# Altium project H93 LDCU FCT Tester.PrjPCB
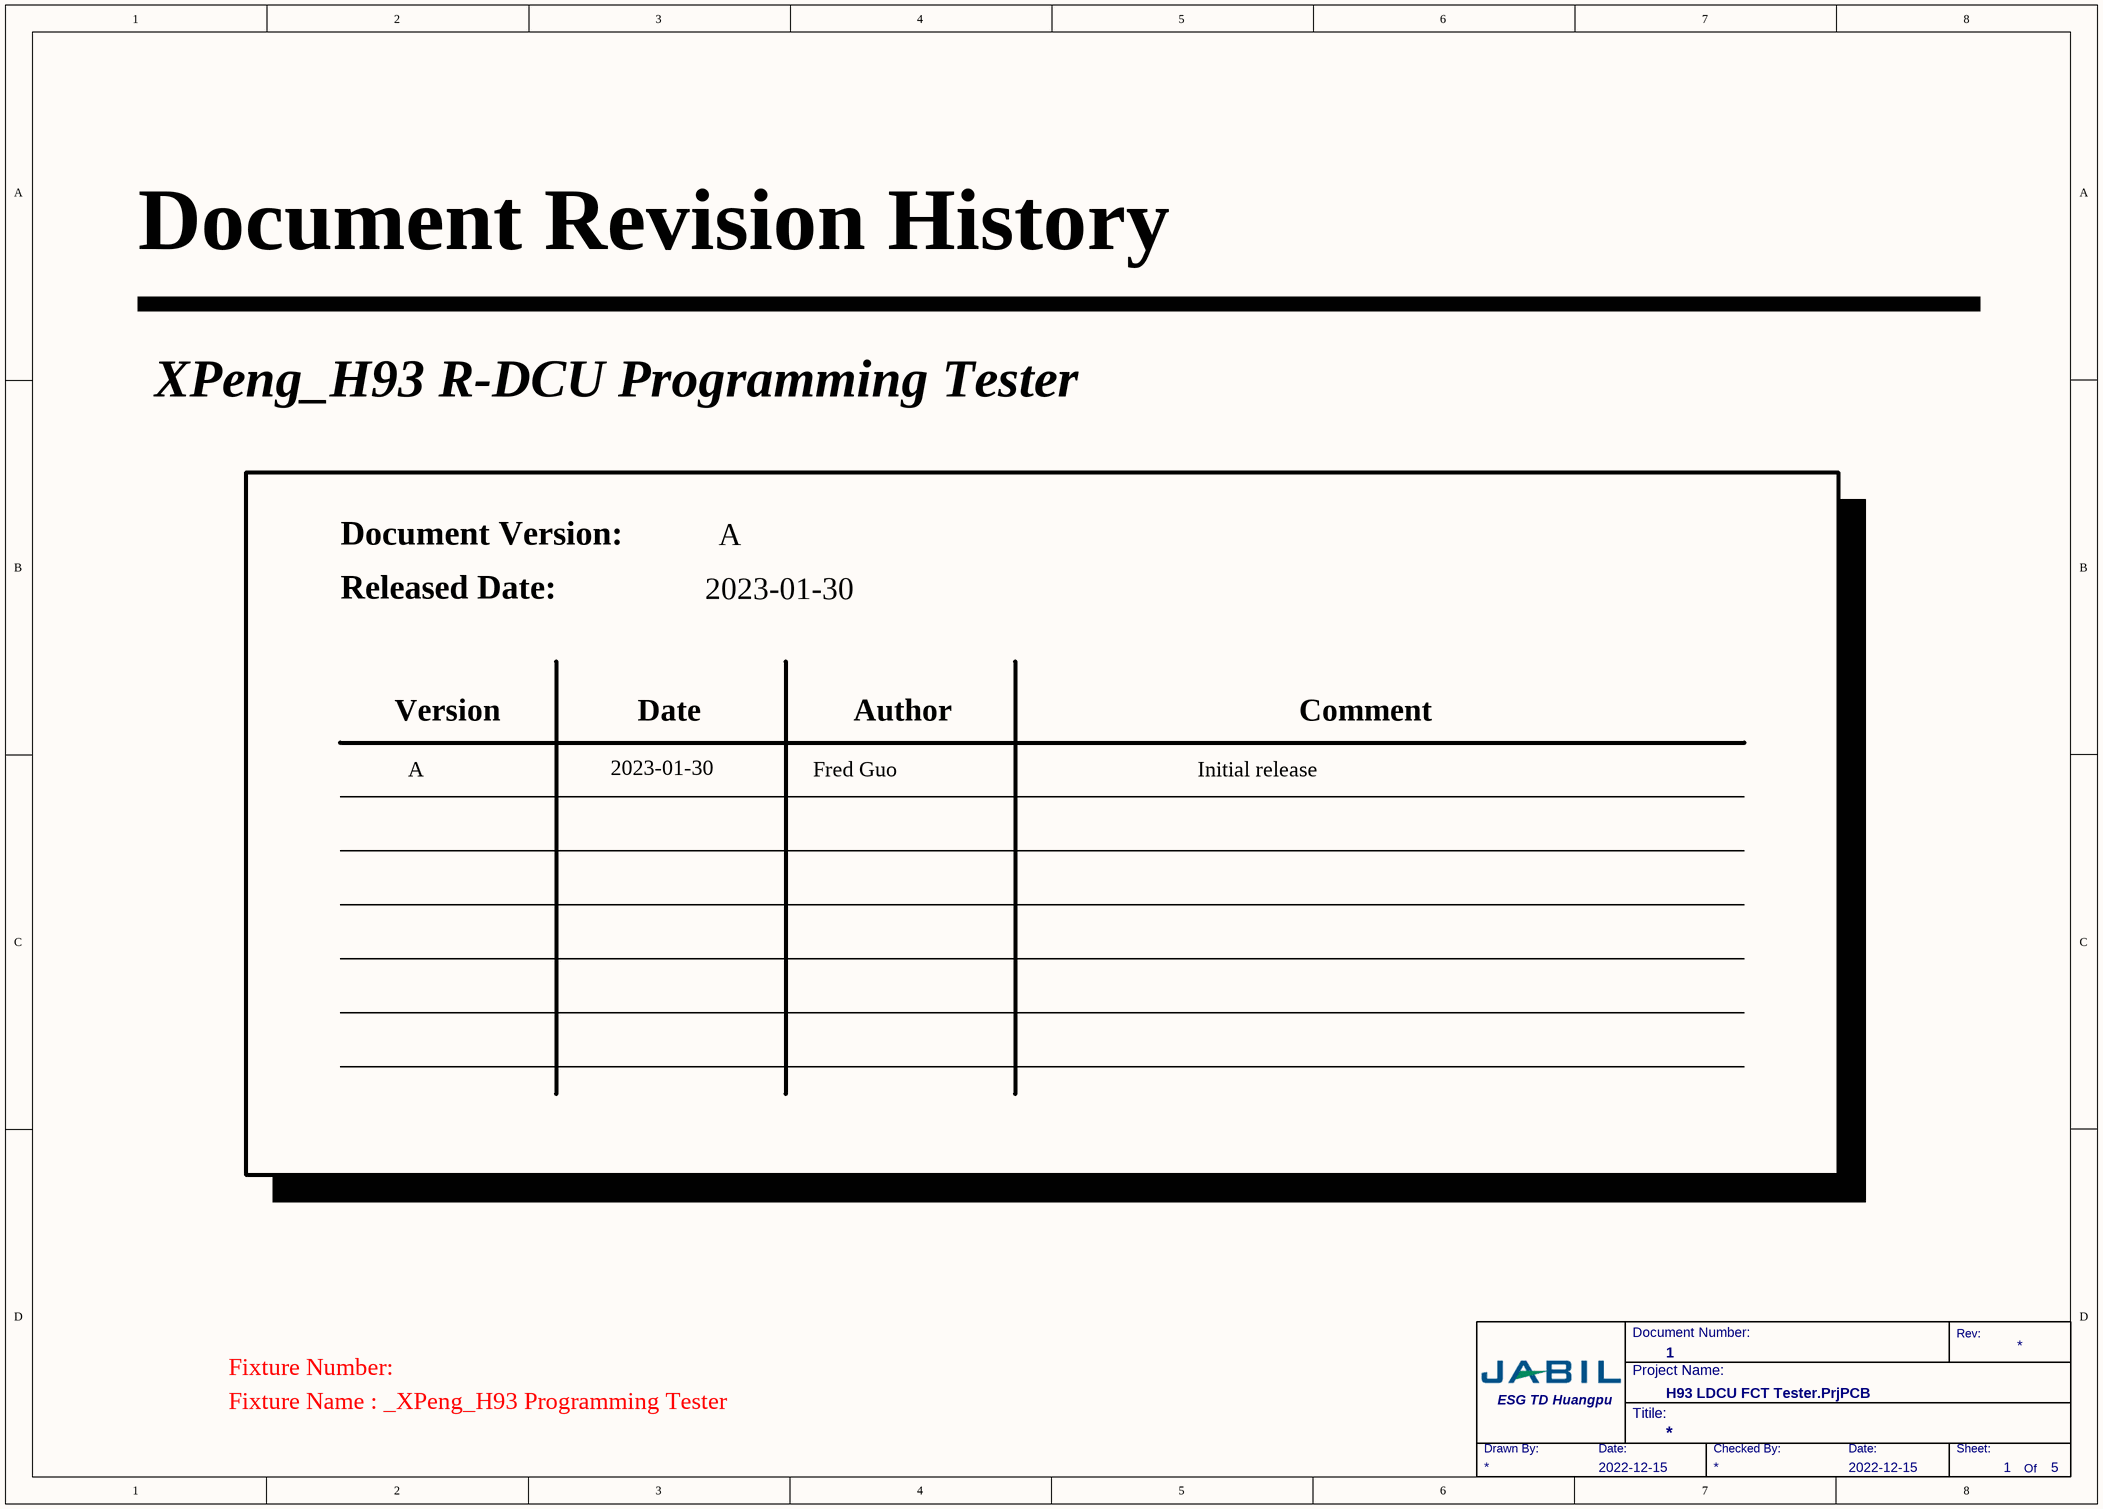
[diagram p0: History.SchDoc]
7 sheets, 50 parts. Net scope: flat (ports and power ports of the same name join across sheets).
Sheets:
  History.SchDoc
  Base AC System.SchDoc
  Base Wiring.SchDoc
  Fixture Control Wiring.SchDoc
  DUT Connect Wiring.SchDoc
  Sheet1.SchDoc
  Sheet2.SchDoc

## Sheet History.SchDoc
size A3; DocumentNumber: 1; SheetNumber: 1; SheetTotal: 5; SheetSize: A3; CheckedByDate: 2022-12-15; DrawByDate: 2022-12-15; SiteName: ESG TD Huangpu

### Notes on the sheet
- Document Revision History
- XPeng_H93 R-DCU Programming Tester
- Document Version:
- A
- Released Date:
- 2023-01-30
- Version
- Date
- Fred Guo
- Author
- Initial release
- Comment
- Fixture Number:
- Fixture Name : _XPeng_H93 Programming Tester
- Document Number:
- Project Name:
- Rev:
- Drawn By:
- Date:
- Titile:
- Checked By:
- Sheet:
- Of

## Sheet Base AC System.SchDoc
size A3; DocumentNumber: 2; SheetNumber: 2; SheetTotal: 5; SheetSize: A3; CheckedByDate: 2022-12-15; DrawByDate: 2022-12-15; SiteName: ESG TD Huangpu
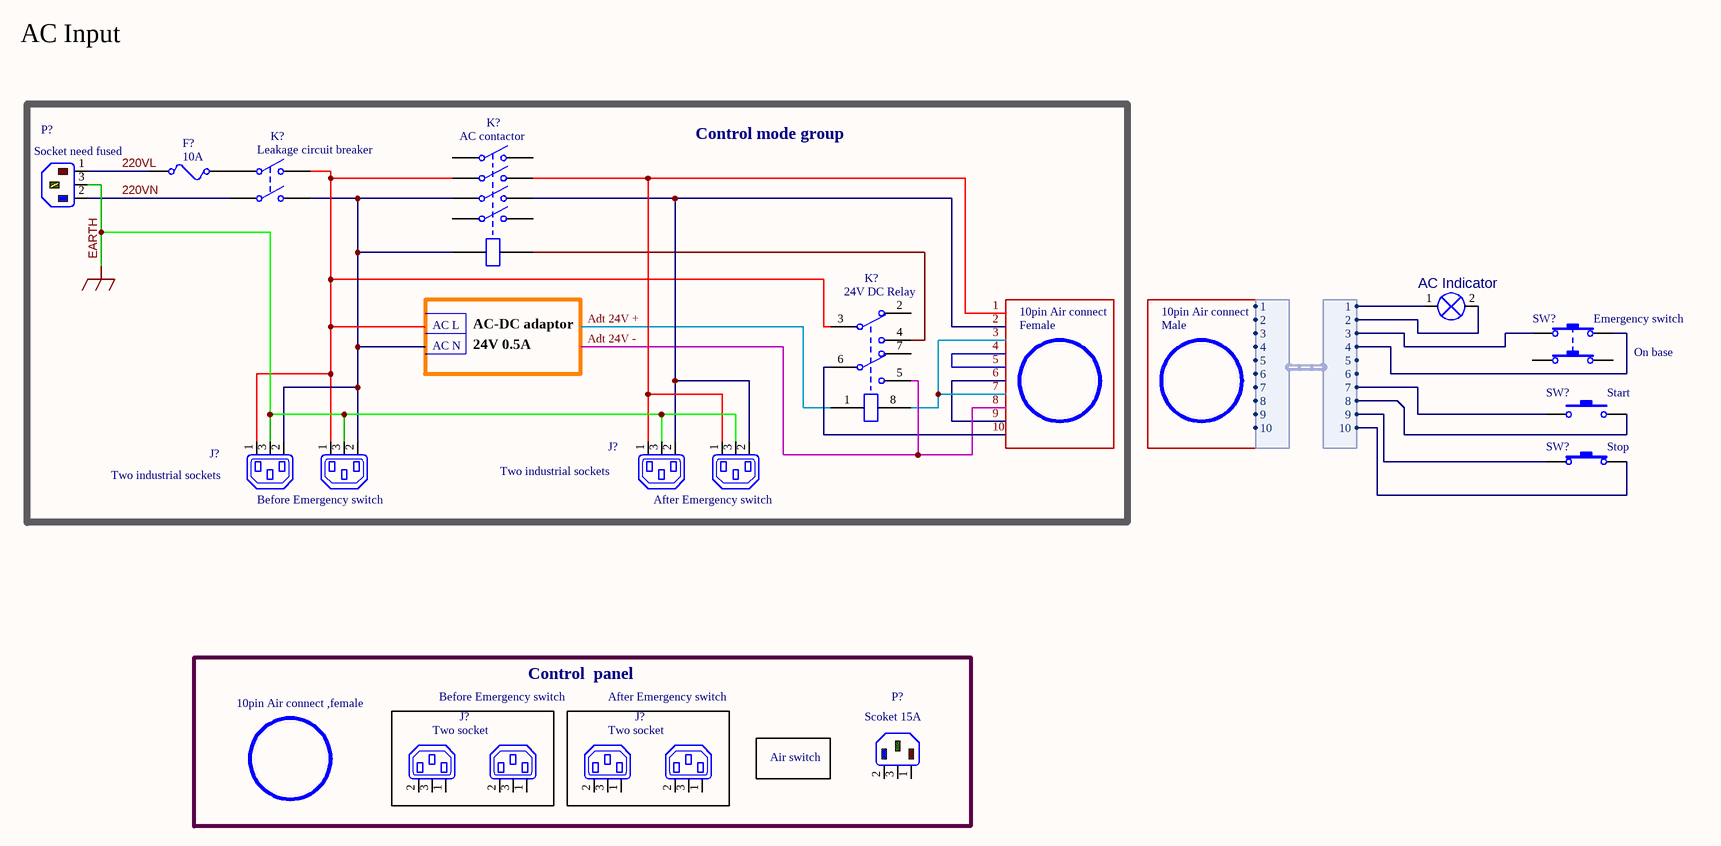
[diagram p1: Base AC System.SchDoc]

### Parts
(Parts that share a designator on the sheet are numbered #1, #2 ... from top to bottom, then left to right.)
F?  10A  [FUSE]
J?#1  Two industrial sockets  [IEC7-2H3]
J?#2  Plug AC Female  [IEC7-2H3]  (value not drawn)
J?#3  Two industrial sockets  [IEC7-2H3]
J?#4  两位工业插座  [IEC7-2H3]  (value not drawn)
J?#5  Two socket  [IEC7-2H3]
J?#6  工业插座  [IEC7-2H3]  (value not drawn)
J?#7  Two socket  [IEC7-2H3]
J?#8  工业插座  [IEC7-2H3]  (value not drawn)
K?#1  Leakage circuit breaker  [DPST-4]
K?#2  AC contactor
K?#3  24V DC Relay  [G2R-2]
Lamp?  AC Indicator
P?#1  Socket need fused  [IEC9.14-2H3]
P?#2  Scoket 15A  [IEC9.14-2H3]
SW?#1  Emergency switch  Remark: On base
SW?#2  Start
SW?#3  Stop

### Blocks framed on the sheet
Control mode group: F? J?#1-J?#4 K?#1-K?#3 P?#1
Control  panel: P?#2
Before Emergency switch: J?#5 J?#6
After Emergency switch: J?#7 J?#8

### Harnesses
Harness8: 1, 2, 3, 4, 5, 6, 7, 8, 9, 10

### Nets
EARTH: J?#1.3(E) J?#2.3(E) J?#3.3(E) J?#4.3(E) P?#1.3(E)  [also labelled GND_EARTH]
1: J?#3.1(L) J?#4.1(L) K?#2.10
2: J?#3.2(N) J?#4.2(N) K?#2.4
3: K?#3.8  [also labelled 7]
8: K?#3.5  [also labelled Adt 24V -]
10: K?#3.6
220VL: F?.1 P?#1.1(L)
220VN: K?#1.3(COMMON2) P?#1.2(N)
Adt 24V +: K?#3.1
NetF?_2: F?.2 K?#1.1(COMMON1)
NetJ?#1_1: J?#1.1(L) J?#2.1(L) K?#1.2(NO1) K?#2.9 K?#3.3
NetJ?#1_2: J?#1.2(N) J?#2.2(N) K?#1.4(NO2) K?#2.1 K?#2.3
NetK?#2_8: K?#2.8 K?#3.4
NetLamp?_1: Lamp?.1 ; harness Harness8.1
NetLamp?_2: Lamp?.2 ; harness Harness8.2
NetSW?#1_1: SW?#1.1 ; harness Harness8.3
NetSW?#1_2: SW?#1.2 ; harness Harness8.4
NetSW?#2_1: SW?#2.1 ; harness Harness8.7
NetSW?#2_2: SW?#2.2 ; harness Harness8.8
NetSW?#3_1: SW?#3.1 ; harness Harness8.9
NetSW?#3_2: SW?#3.2 ; harness Harness8.10

Not connected (* = marked no-connect by the designer): J?#5 1(L) 2(N) 3(E); J?#6 1(L) 2(N) 3(E); J?#7 1(L) 2(N) 3(E); J?#8 1(L) 2(N) 3(E); K?#2 6 7 11 12; K?#3 2 7; P?#2 1(L) 2(N) 3(E); SW?#1 3 4

### Notes on the sheet
- AC Input
- AC L
- AC N
- AC-DC adaptor
- 24V 0.5A
- 10pin Air connect
- Female
- Male
- (near J?#2) Before Emergency switch
- (near J?#3) After Emergency switch
- 10pin Air connect ,female
- Air switch
- Document Number:
- Project Name:
- Rev:
- Drawn By:
- Date:
- Titile:
- Checked By:
- Sheet:
- Of

### Library data of the parts
F? = FUSE
J?#1-J?#8 = Plug AC Female: IEC Mains Power Outlet, EN60 320-2-2 F Class I, PC Flange Rear Mount, Chassis Socket; PackageDocument: ver.80, 15-Sep-2003; MaximumRating: 10A, 250V a.c. (UL & CSA 15A, 250V a.c.); MountingFixtures: Not drawn on schematic symbol.; PCB_Layout: Complies with manufacturer's recommendation.; DrillSize: Corresponds to nominal value.; Published: 15-Jul-2004; LatestRevisionDate: 15-Jul-2004; LatestRevisionNote: Component Replaced & renamed from "Phonejack".; DatasheetDocument: ver.80, 15-Sep-2003; PackageReference: PX0675/PC; Publisher: Altium Limited; Terminations: P.C. Spills; ComponentLink1Description: Manufacturer Link; ComponentLink1URL: http://www.bulgin.co.uk/
K?#1 = SW-DPST: Double-Pole, Single-Throw Switch; Published: 24-Mar-1999; LatestRevisionDate: 17-Jul-2002; LatestRevisionNote: Re-released for DXP Platform.; PackageReference: DPST-4; Publisher: Altium Limited
K?#2 = AC CONTACTER
K?#3 = G2R-2
Lamp? = Lamp3
P?#1 P?#2 = Plug AC Male: IEC Mains Power Inlet, EN60 320-1 C14 Class I Cold Condition, PC Flange Rear Mount, Chassis Plug; PackageDocument: ver.80, 15-Sep-2003; MaximumRating: 10A, 250V a.c. (UL & CSA 15A, 250V a.c.); MountingFixtures: Not drawn on schematic symbol.; PCB_Layout: Complies with manufacturer's recommendation.; DrillSize: Corresponds to nominal value.; Note: IEC Color Scheme employed for L, N and E.; Published: 15-Jul-2004; LatestRevisionDate: 15-Jul-2004; LatestRevisionNote: Component Replaced.; DatasheetDocument: ver.80, 15-Sep-2003; PackageReference: PX0580/PC; Publisher: Altium Limited; Terminations: P.C. Spills; ComponentLink1Description: Manufacturer Link; ComponentLink1URL: http://www.bulgin.co.uk/
SW?#1 = Emergency: Switch; Published: 24-Mar-1999; LatestRevisionDate: 17-Jul-2002; LatestRevisionNote: Re-released for DXP Platform.; PackageReference: SPST-2; Publisher: Altium Limited
SW?#2 = SW-NO: Switch; Published: 24-Mar-1999; LatestRevisionDate: 17-Jul-2002; LatestRevisionNote: Re-released for DXP Platform.; PackageReference: SPST-2; Publisher: Altium Limited
SW?#3 = SW-NC: Switch; Published: 24-Mar-1999; LatestRevisionDate: 17-Jul-2002; LatestRevisionNote: Re-released for DXP Platform.; PackageReference: SPST-2; Publisher: Altium Limited

## Sheet Base Wiring.SchDoc
size A3; DocumentNumber: 3; SheetNumber: 3; SheetTotal: 5; SheetSize: A3; CheckedByDate: 2022-12-15; DrawByDate: 2022-12-15; SiteName: ESG TD Huangpu
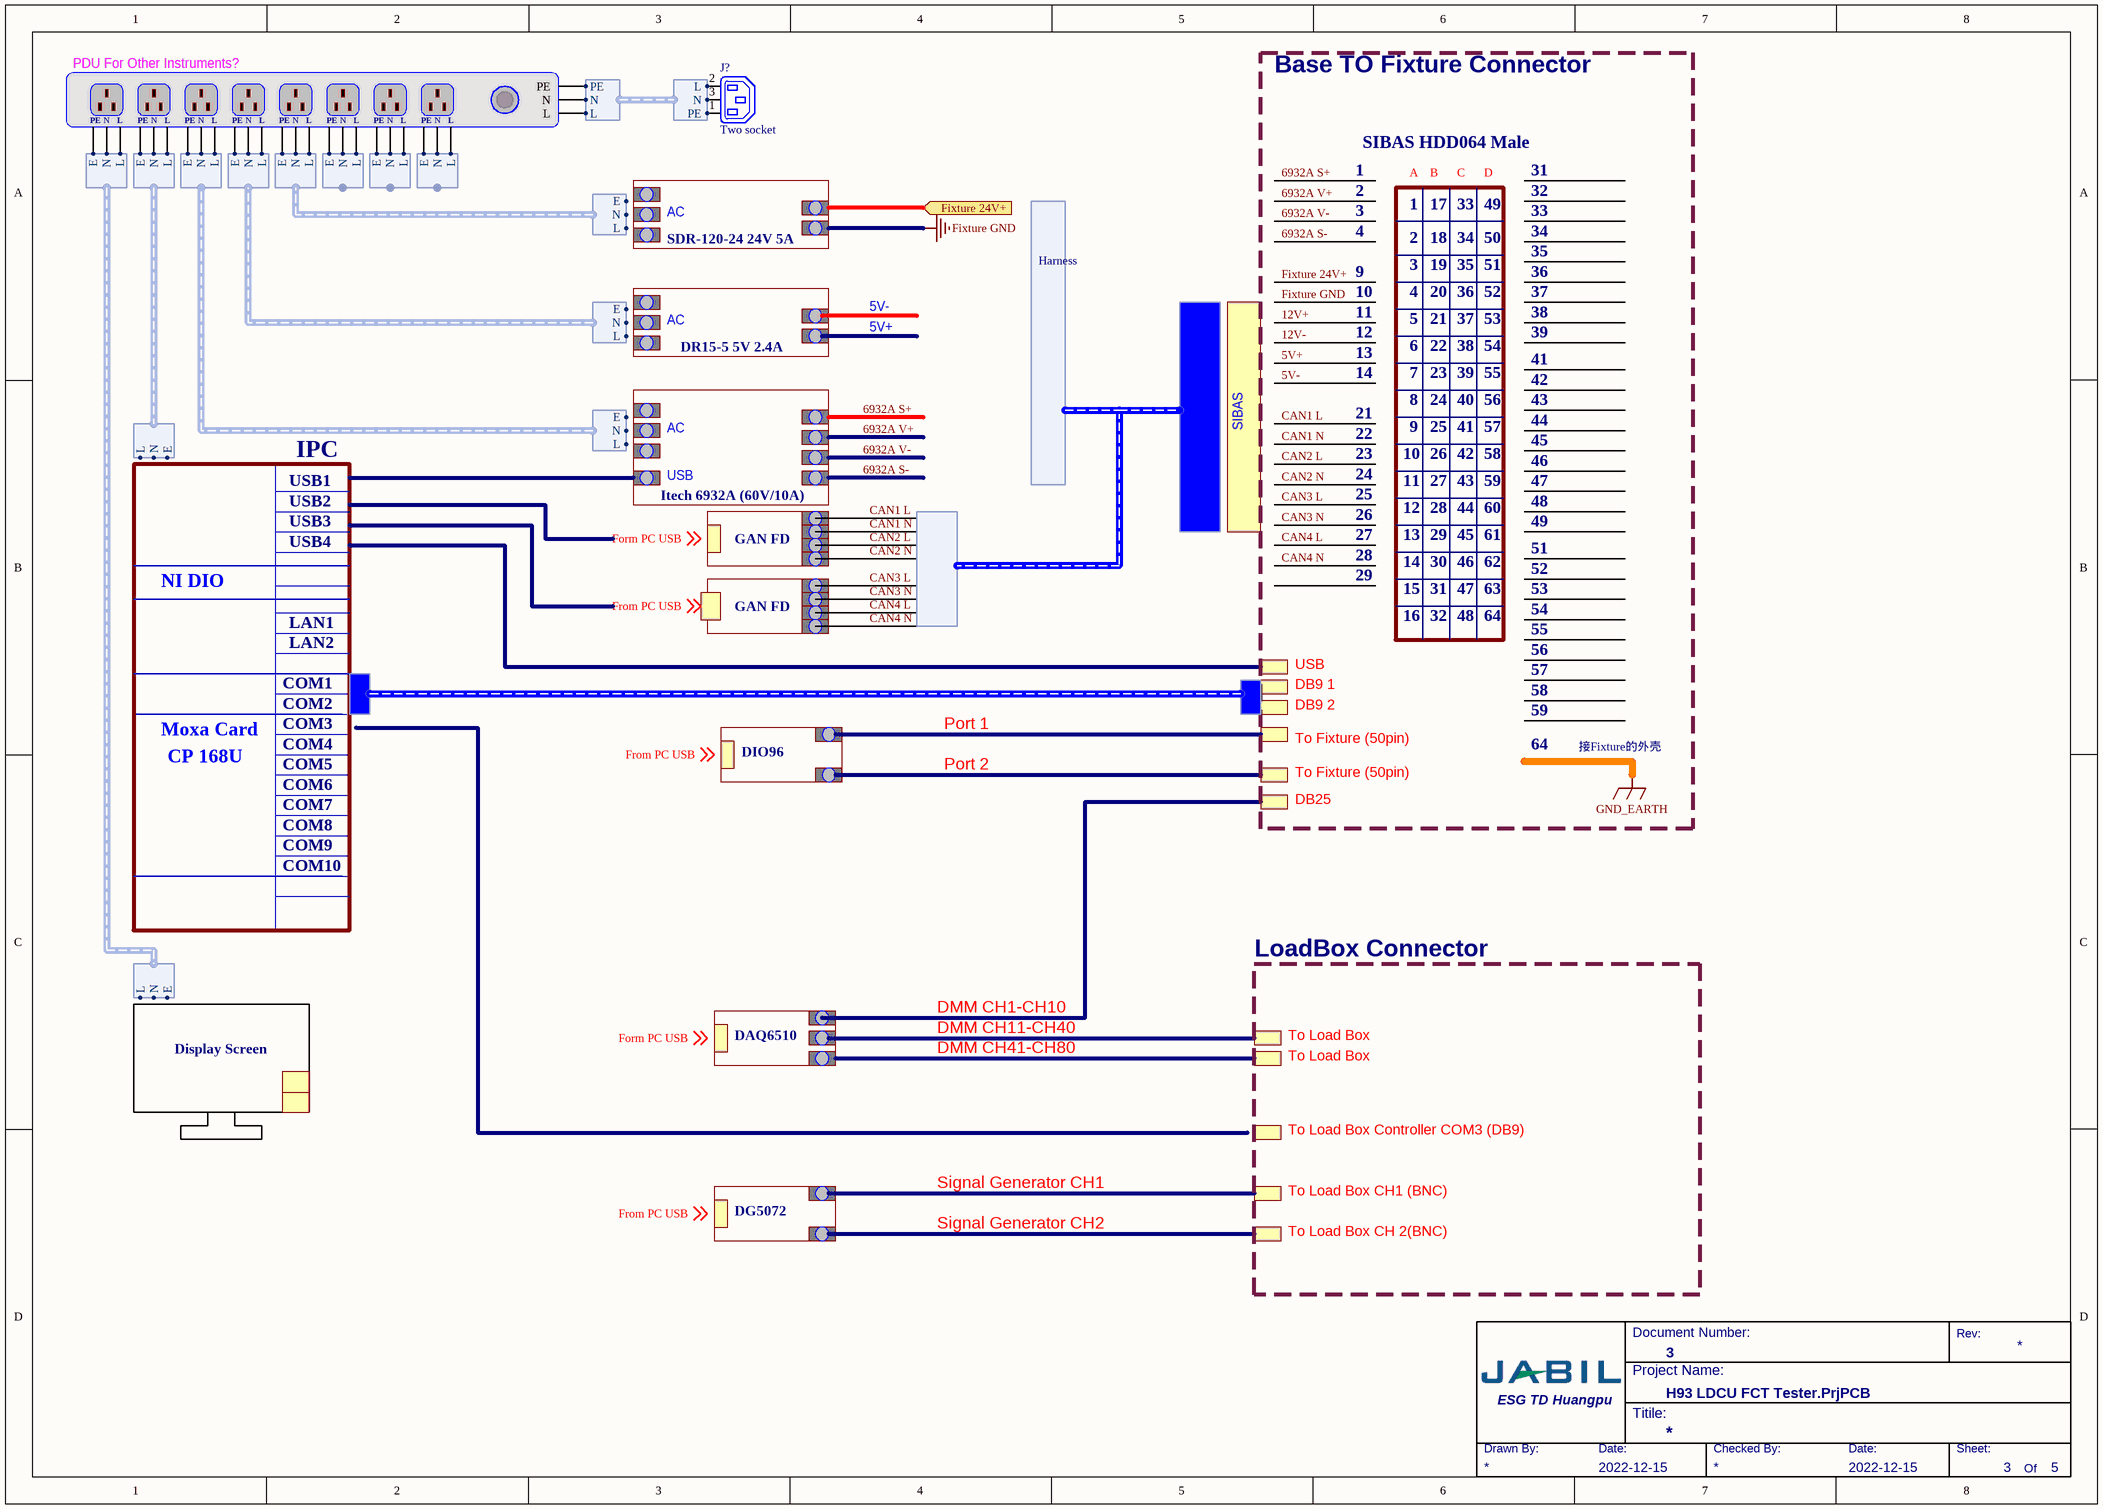
[diagram p2: Base Wiring.SchDoc]

### Parts
(Parts that share a designator on the sheet are numbered #1, #2 ... from top to bottom, then left to right.)
J?#9  Two socket  [IEC7-2H3]
PDU_For_Other_Instruments?  PDU  (value not drawn)

### Ports
Fixture 24V+ (in)

### Harnesses
Power Cord: E, N, L
Power Cord: L, N, PE
Harness: 

### Nets
NetJ?#9_1: J?#9.1(L) PDU_For_Other_Instruments?.1(PE) ; harness Power Cord.PE
NetJ?#9_2: J?#9.2(N) PDU_For_Other_Instruments?.3(L) ; harness Power Cord.L
NetJ?#9_3: J?#9.3(E) PDU_For_Other_Instruments?.2(N) ; harness Power Cord.N
NetPDU_For_Other_Instruments?_4: PDU_For_Other_Instruments?.4(L) ; harness Power Cord.L
NetPDU_For_Other_Instruments?_5: PDU_For_Other_Instruments?.5(N) ; harness Power Cord.N
NetPDU_For_Other_Instruments?_6: PDU_For_Other_Instruments?.6(PE) ; harness Power Cord.E
NetPDU_For_Other_Instruments?_7: PDU_For_Other_Instruments?.7(PE) ; harness Power Cord.L
NetPDU_For_Other_Instruments?_8: PDU_For_Other_Instruments?.8(PE) ; harness Power Cord.N
NetPDU_For_Other_Instruments?_9: PDU_For_Other_Instruments?.9(PE) ; harness Power Cord.E
NetPDU_For_Other_Instruments?_10: PDU_For_Other_Instruments?.10(PE) ; harness Power Cord.L
NetPDU_For_Other_Instruments?_11: PDU_For_Other_Instruments?.11(PE) ; harness Power Cord.N
NetPDU_For_Other_Instruments?_12: PDU_For_Other_Instruments?.12(PE) ; harness Power Cord.E
NetPDU_For_Other_Instruments?_13: PDU_For_Other_Instruments?.13(PE) ; harness Power Cord.L
NetPDU_For_Other_Instruments?_14: PDU_For_Other_Instruments?.14(PE) ; harness Power Cord.N
NetPDU_For_Other_Instruments?_15: PDU_For_Other_Instruments?.15(PE) ; harness Power Cord.E
NetPDU_For_Other_Instruments?_16: PDU_For_Other_Instruments?.16(PE) ; harness Power Cord.L
NetPDU_For_Other_Instruments?_17: PDU_For_Other_Instruments?.17(PE) ; harness Power Cord.N
NetPDU_For_Other_Instruments?_18: PDU_For_Other_Instruments?.18(PE) ; harness Power Cord.E
NetPDU_For_Other_Instruments?_19: PDU_For_Other_Instruments?.19(PE) ; harness Power Cord.L
NetPDU_For_Other_Instruments?_20: PDU_For_Other_Instruments?.20(PE) ; harness Power Cord.N
NetPDU_For_Other_Instruments?_21: PDU_For_Other_Instruments?.21(PE) ; harness Power Cord.E
NetPDU_For_Other_Instruments?_22: PDU_For_Other_Instruments?.22(PE) ; harness Power Cord.L
NetPDU_For_Other_Instruments?_23: PDU_For_Other_Instruments?.23(PE) ; harness Power Cord.N
NetPDU_For_Other_Instruments?_24: PDU_For_Other_Instruments?.24(PE) ; harness Power Cord.E
NetPDU_For_Other_Instruments?_25: PDU_For_Other_Instruments?.25(PE) ; harness Power Cord.L
NetPDU_For_Other_Instruments?_26: PDU_For_Other_Instruments?.26(PE) ; harness Power Cord.N
NetPDU_For_Other_Instruments?_27: PDU_For_Other_Instruments?.27(PE) ; harness Power Cord.E

### Notes on the sheet
- Base TO Fixture Connector
- 1
- SIBAS HDD064 Male
- A
- B
- C
- D
- 31
- AC
- SDR-120-24 24V 5A
- 2
- 3
- 4
- 17
- 18
- 33
- 34
- 49
- 50
- 32
- 5V-
- 9
- 10
- 11
- 19
- 20
- 35
- 36
- 51
- 52
- 38
- 37
- DR15-5 5V 2.4A
- 5V+
- 12
- 14
- 13
- 5
- 6
- 7
- 21
- 22
- 23
- 39
- 53
- 54
- 55
- 41
- SIBAS
- 8
- 24
- 25
- 40
- 56
- 57
- 42
- 43
- 44
- 45
- USB1
- USB2
- IPC
- Itech 6932A (60V/10A)
- USB
- 26
- 27
- 28
- 58
- 59
- 60
- 46
- 48
- 47
- NI DIO
- USB3
- USB4
- GAN FD
- 29
- 30
- 61
- 62
- LAN2
- LAN1
- 15
- 16
- 63
- 64
- COM1
- COM2
- DB9 1
- DB9 2
- Moxa Card
- CP 168U
- COM5
- COM3
- COM4
- DIO96
- Port 1
- Port 2
- To Fixture (50pin)
- 接Fixture的外壳
- COM6
- COM7
- COM8
- COM9
- DB25
- COM10
- LoadBox Connector
- Display Screen
- DAQ6510
- DMM CH1-CH10
- DMM CH41-CH80
- DMM CH11-CH40
- To Load Box
- Signal Generator CH1
- To Load Box Controller COM3 (DB9)
- DG5072
- Signal Generator CH2
- To Load Box CH1 (BNC)
- To Load Box CH 2(BNC)
- Labels drawn without touching a wire or pin: 5V+, 5V-, 12V+, 12V-, 6932A S+, 6932A S-, 6932A V+, 6932A V-, CAN1 L, CAN1 N, CAN2 L, CAN2 N, CAN3 L, CAN3 N, CAN4 L, CAN4 N, Fixture 24V+, Fixture GND, Form PC USB, From PC USB
- Document Number:
- Project Name:
- Rev:
- Drawn By:
- Date:
- Titile:
- Checked By:
- Sheet:
- Of

### Library data of the parts
J?#9 = Plug AC Female: as J?#1 on sheet Base AC System; Published: 15-Jul-2004; LatestRevisionDate: 15-Jul-2004; LatestRevisionNote: Component Replaced & renamed from "Phonejack".; DatasheetDocument: ver.80, 15-Sep-2003; PackageReference: PX0675/PC; Publisher: Altium Limited; Terminations: P.C. Spills; ComponentLink1Description: Manufacturer Link; ComponentLink1URL: http://www.bulgin.co.uk/

## Sheet Fixture Control Wiring.SchDoc
size A3; DrawnBy: Fred Guo; DocumentNumber: 4; SheetNumber: 4; SheetTotal: 5; SheetSize: A3; DrawByDate: 2023-02-05; SiteName: ESG TD Huangpu
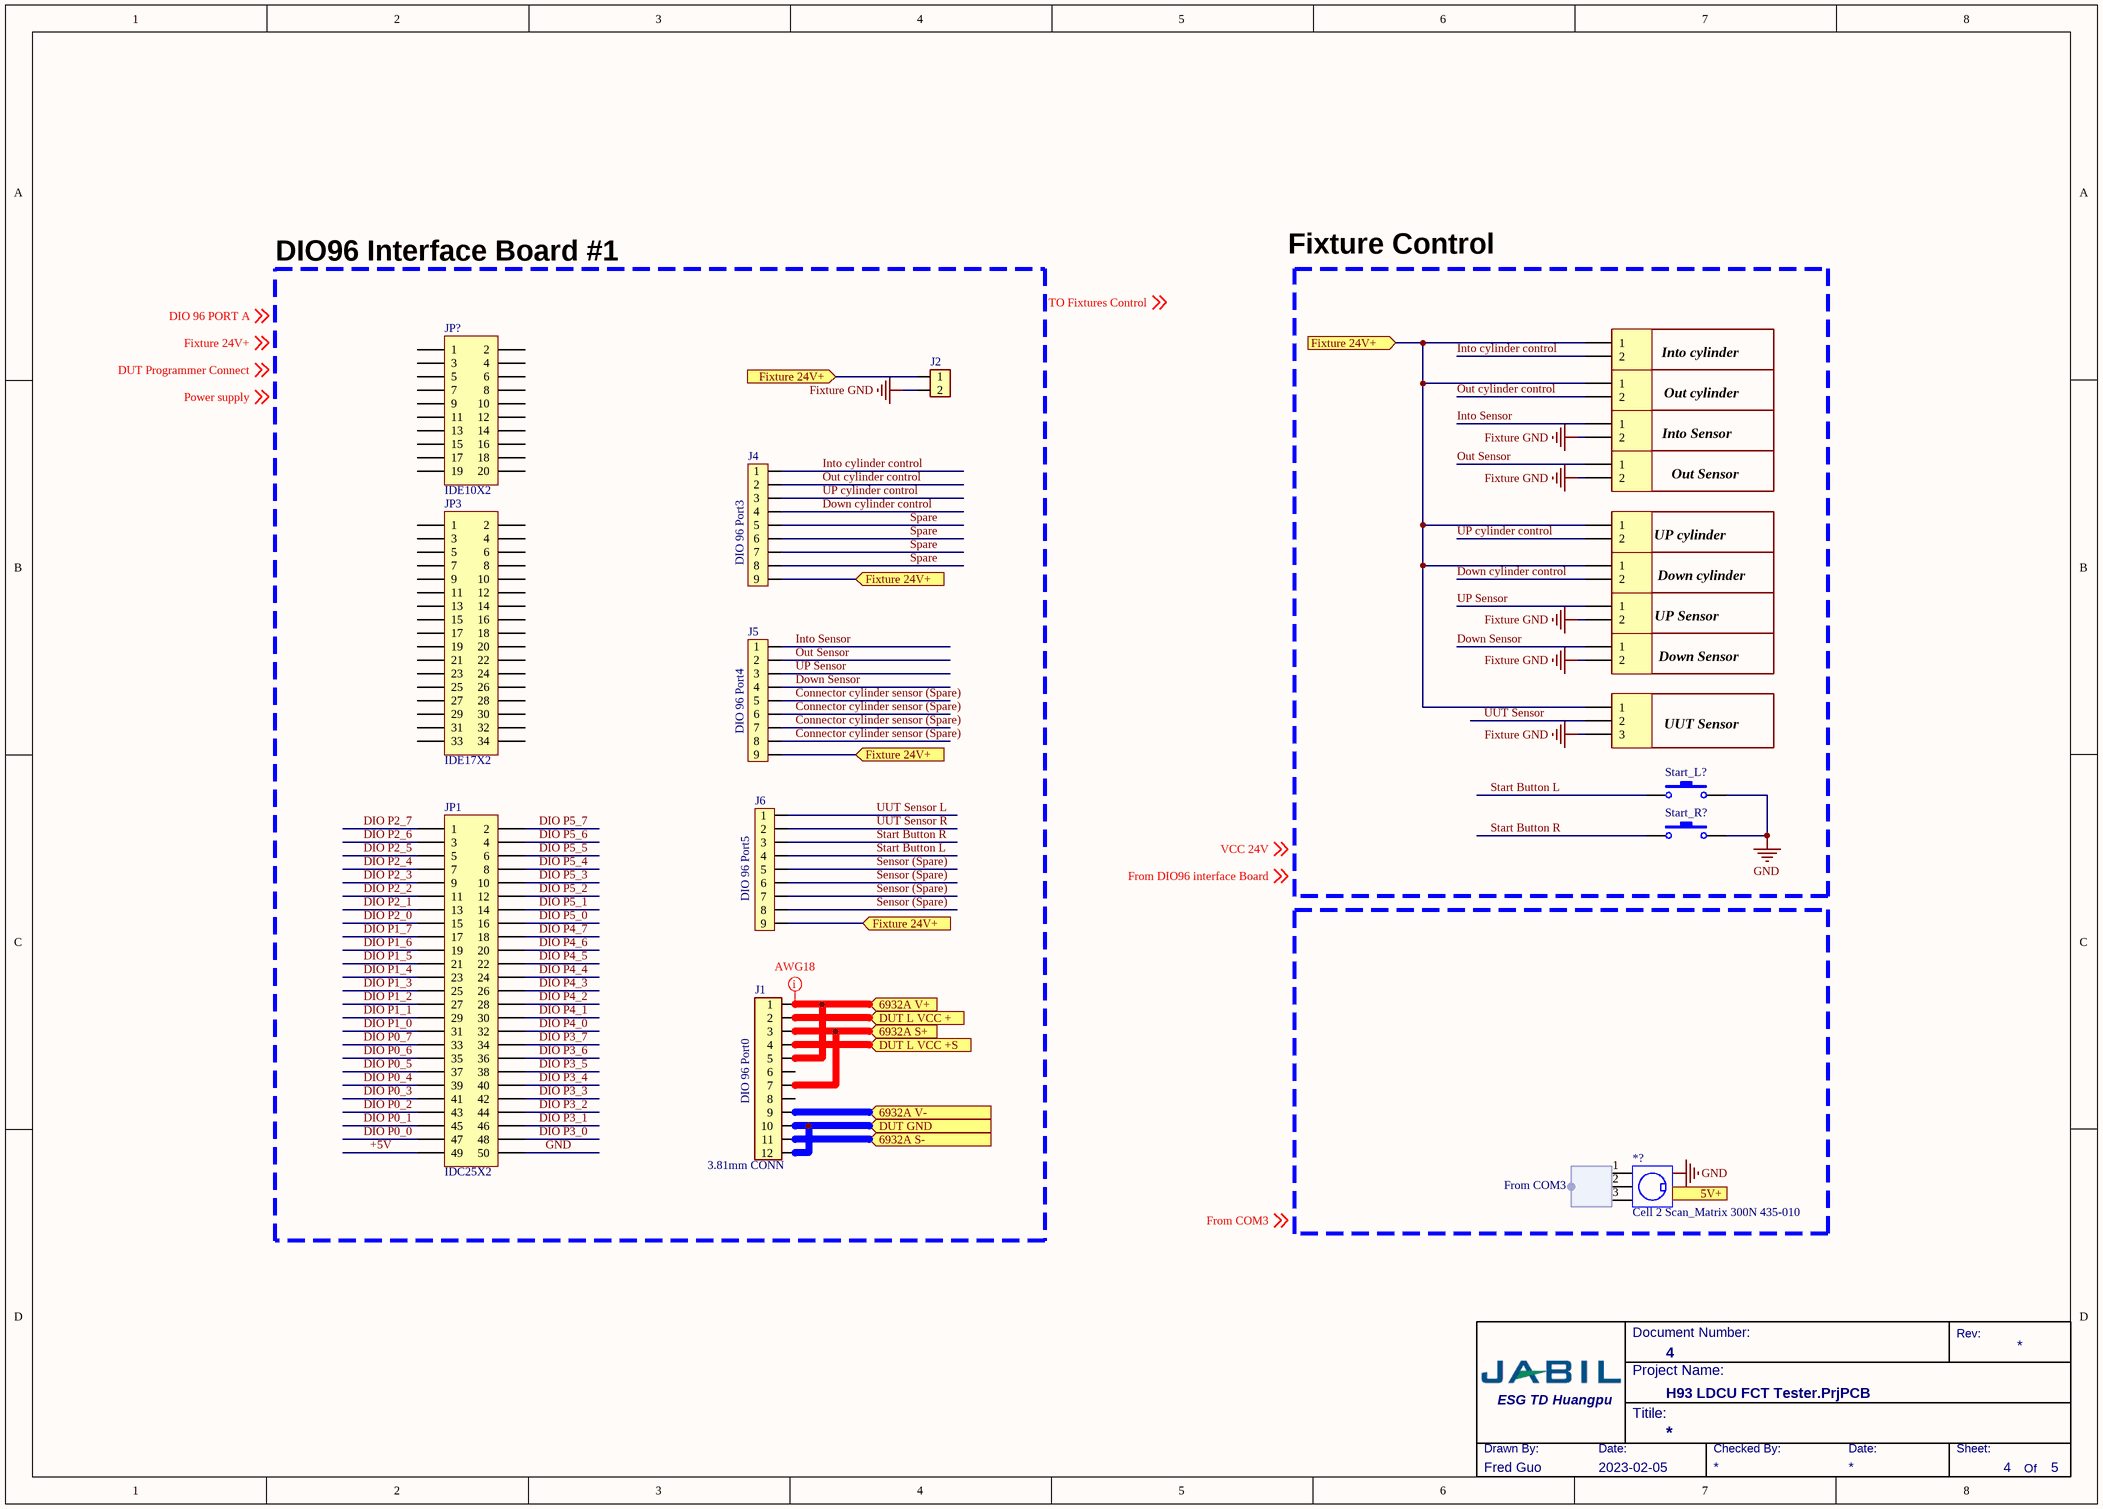
[diagram p3: Fixture Control Wiring.SchDoc]

### Parts
(Parts that share a designator on the sheet are numbered #1, #2 ... from top to bottom, then left to right.)
*?  Cell 2 Scan_Matrix 300N 435-010
?  J5  [2.54mm-9]
J1  3.81mm CONN  [3.81MM-12-Bend]
J2  (no value)  [3.81mm-2]
J?#10  (no value)  [HDR1X2H]
J?#11  (no value)  [HDR1X2H]
J?#12  (no value)  [HDR1X2H]
J?#13  (no value)  [HDR1X2H]
J?#14  J4  [2.54mm-9]
J?#15  (no value)  [HDR1X2H]
J?#16  (no value)  [HDR1X2H]
J?#17  (no value)  [HDR1X2H]
J?#18  (no value)  [HDR1X2H]
J?#19  J6  [2.54mm-9]
JP1  IDC25X2  [IDC50]
JP3  IDE17X2  [IDE34]
JP?  IDE10X2  [IDE20]
Sensor?  COM GND  [HDR1X3]  (value not drawn)
Start_L?  (no value)
Start_R?  (no value)

### Blocks framed on the sheet
Into cylinder: J?#10
Out cylinder: J?#11
Into Sensor: J?#12
Out Sensor: J?#13
Down cylinder: J?#16
UP cylinder: J?#15
UP Sensor: J?#17
Down Sensor: J?#18
UUT Sensor: Sensor?

### Ports
5V+ (in), 6932A S+ (in), 6932A S- (in), 6932A V+ (in), 6932A V- (in), DUT GND (in), DUT L VCC + (in), DUT L VCC +S (in), Fixture 24V+ (in)

### Harnesses
From COM3: 

### Nets
Fixture GND: J2.2 J?#12.2 J?#13.2 J?#17.2 J?#18.2 Sensor?.3
GND: JP1.50 Start_L?.2 Start_R?.2
+5V: JP1.49
Connector cylinder sensor (Spare): ?.5 ?.6 ?.7 ?.8
DIO P0_0: JP1.47
DIO P0_1: JP1.45
DIO P0_2: JP1.43
DIO P0_3: JP1.41
DIO P0_4: JP1.39
DIO P0_5: JP1.37
DIO P0_6: JP1.35
DIO P0_7: JP1.33
DIO P1_0: JP1.31
DIO P1_1: JP1.29
DIO P1_2: JP1.27
DIO P1_3: JP1.25
DIO P1_4: JP1.23
DIO P1_5: JP1.21
DIO P1_6: JP1.19
DIO P1_7: JP1.17
DIO P2_0: JP1.15
DIO P2_1: JP1.13
DIO P2_2: JP1.11
DIO P2_3: JP1.9
DIO P2_4: JP1.7
DIO P2_5: JP1.5
DIO P2_6: JP1.3
DIO P2_7: JP1.1
DIO P3_0: JP1.48
DIO P3_1: JP1.46
DIO P3_2: JP1.44
DIO P3_3: JP1.42
DIO P3_4: JP1.40
DIO P3_5: JP1.38
DIO P3_6: JP1.36
DIO P3_7: JP1.34
DIO P4_0: JP1.32
DIO P4_1: JP1.30
DIO P4_2: JP1.28
DIO P4_3: JP1.26
DIO P4_4: JP1.24
DIO P4_5: JP1.22
DIO P4_6: JP1.20
DIO P4_7: JP1.18
DIO P5_0: JP1.16
DIO P5_1: JP1.14
DIO P5_2: JP1.12
DIO P5_3: JP1.10
DIO P5_4: JP1.8
DIO P5_5: JP1.6
DIO P5_6: JP1.4
DIO P5_7: JP1.2
Down cylinder control: J?#14.4 J?#16.2
Down Sensor: ?.4 J?#18.1
Into cylinder control: J?#10.2 J?#14.1
Into Sensor: ?.1 J?#12.1
Out cylinder control: J?#11.2 J?#14.2
Out Sensor: ?.2 J?#13.1
Sensor (Spare): J?#19.5 J?#19.6 J?#19.7 J?#19.8
Spare: J?#14.5 J?#14.6 J?#14.7 J?#14.8
Start Button L: J?#19.4 Start_L?.1
Start Button R: J?#19.3 Start_R?.1
UP cylinder control: J?#14.3 J?#15.2
UP Sensor: ?.3 J?#17.1
UUT Sensor: Sensor?.2
UUT Sensor L: J?#19.1
UUT Sensor R: J?#19.2
Net?_9: ?.9 J2.1 J?#10.1 J?#11.1 J?#14.9 J?#15.1 J?#16.1 J?#19.9 Sensor?.1 ; port Fixture 24V+
NetJ1_1: J1.1 J1.5 ; port 6932A V+
NetJ1_2: J1.2 ; port DUT L VCC +
NetJ1_3: J1.3 J1.7 ; port 6932A S+
NetJ1_4: J1.4 ; port DUT L VCC +S
NetJ1_9: J1.9 ; port 6932A V-
NetJ1_10: J1.10 J1.12 ; port DUT GND
NetJ1_11: J1.11 ; port 6932A S-

Not connected (* = marked no-connect by the designer): *? 1 2 3; J1 6 8; JP3 1 2 3 4 5 6 7 8 9 10 11 12 13 14 15 16 17 18 19 20 21 22 23 24 25 26 27 28 29 30 31 32 33 34; JP? 1 2 3 4 5 6 7 8 9 10 11 12 13 14 15 16 17 18 19 20

### Layout directives
net class Undefined: NetJ1_1

### Notes on the sheet
- DIO96 Interface Board #1
- Fixture Control
- (near J?#14) DIO 96 Port3
- DIO 96 Port4
- (near J?#19) DIO 96 Port5
- (near J1) DIO 96 Port0
- Labels drawn without touching a wire or pin: DIO 96 PORT A, DUT Programmer Connect, Fixture 24V+, From COM3, From DIO96 interface Board, GND, Power supply, TO Fixtures Control, VCC 24V
- Document Number:
- Project Name:
- Rev:
- Drawn By:
- Date:
- Titile:
- Checked By:
- Sheet:
- Of

### Library data of the parts
*? = Mil-Connector-3-???_1
? J?#14 J?#19 = CON9-2.54: Connector
J1 = CON12-3.81
J2 = CON2-3.81
J?#10-J?#13 J?#15-J?#18 = Header 2H: Header, 2-Pin, Right Angle; LatestRevisionDate: 17-Jul-2002; LatestRevisionNote: Re-released for DXP Platform.; Publisher: Altium Limited
Sensor? = Header 3: Header, 3-Pin; LatestRevisionDate: 17-Jul-2002; LatestRevisionNote: Re-released for DXP Platform.; Publisher: Altium Limited
Start_L? Start_R? = SW_NO: Switch; Published: 24-Mar-1999; LatestRevisionDate: 17-Jul-2002; LatestRevisionNote: Re-released for DXP Platform.; PackageReference: SPST-2; Publisher: Altium Limited

## Sheet DUT Connect Wiring.SchDoc
size A3; DocumentNumber: 5; SheetNumber: 5; SheetTotal: 5; SheetSize: A3; CheckedByDate: 2022-412-415; DrawByDate: 2022-412-415; SiteName: ESG TD Huangpu
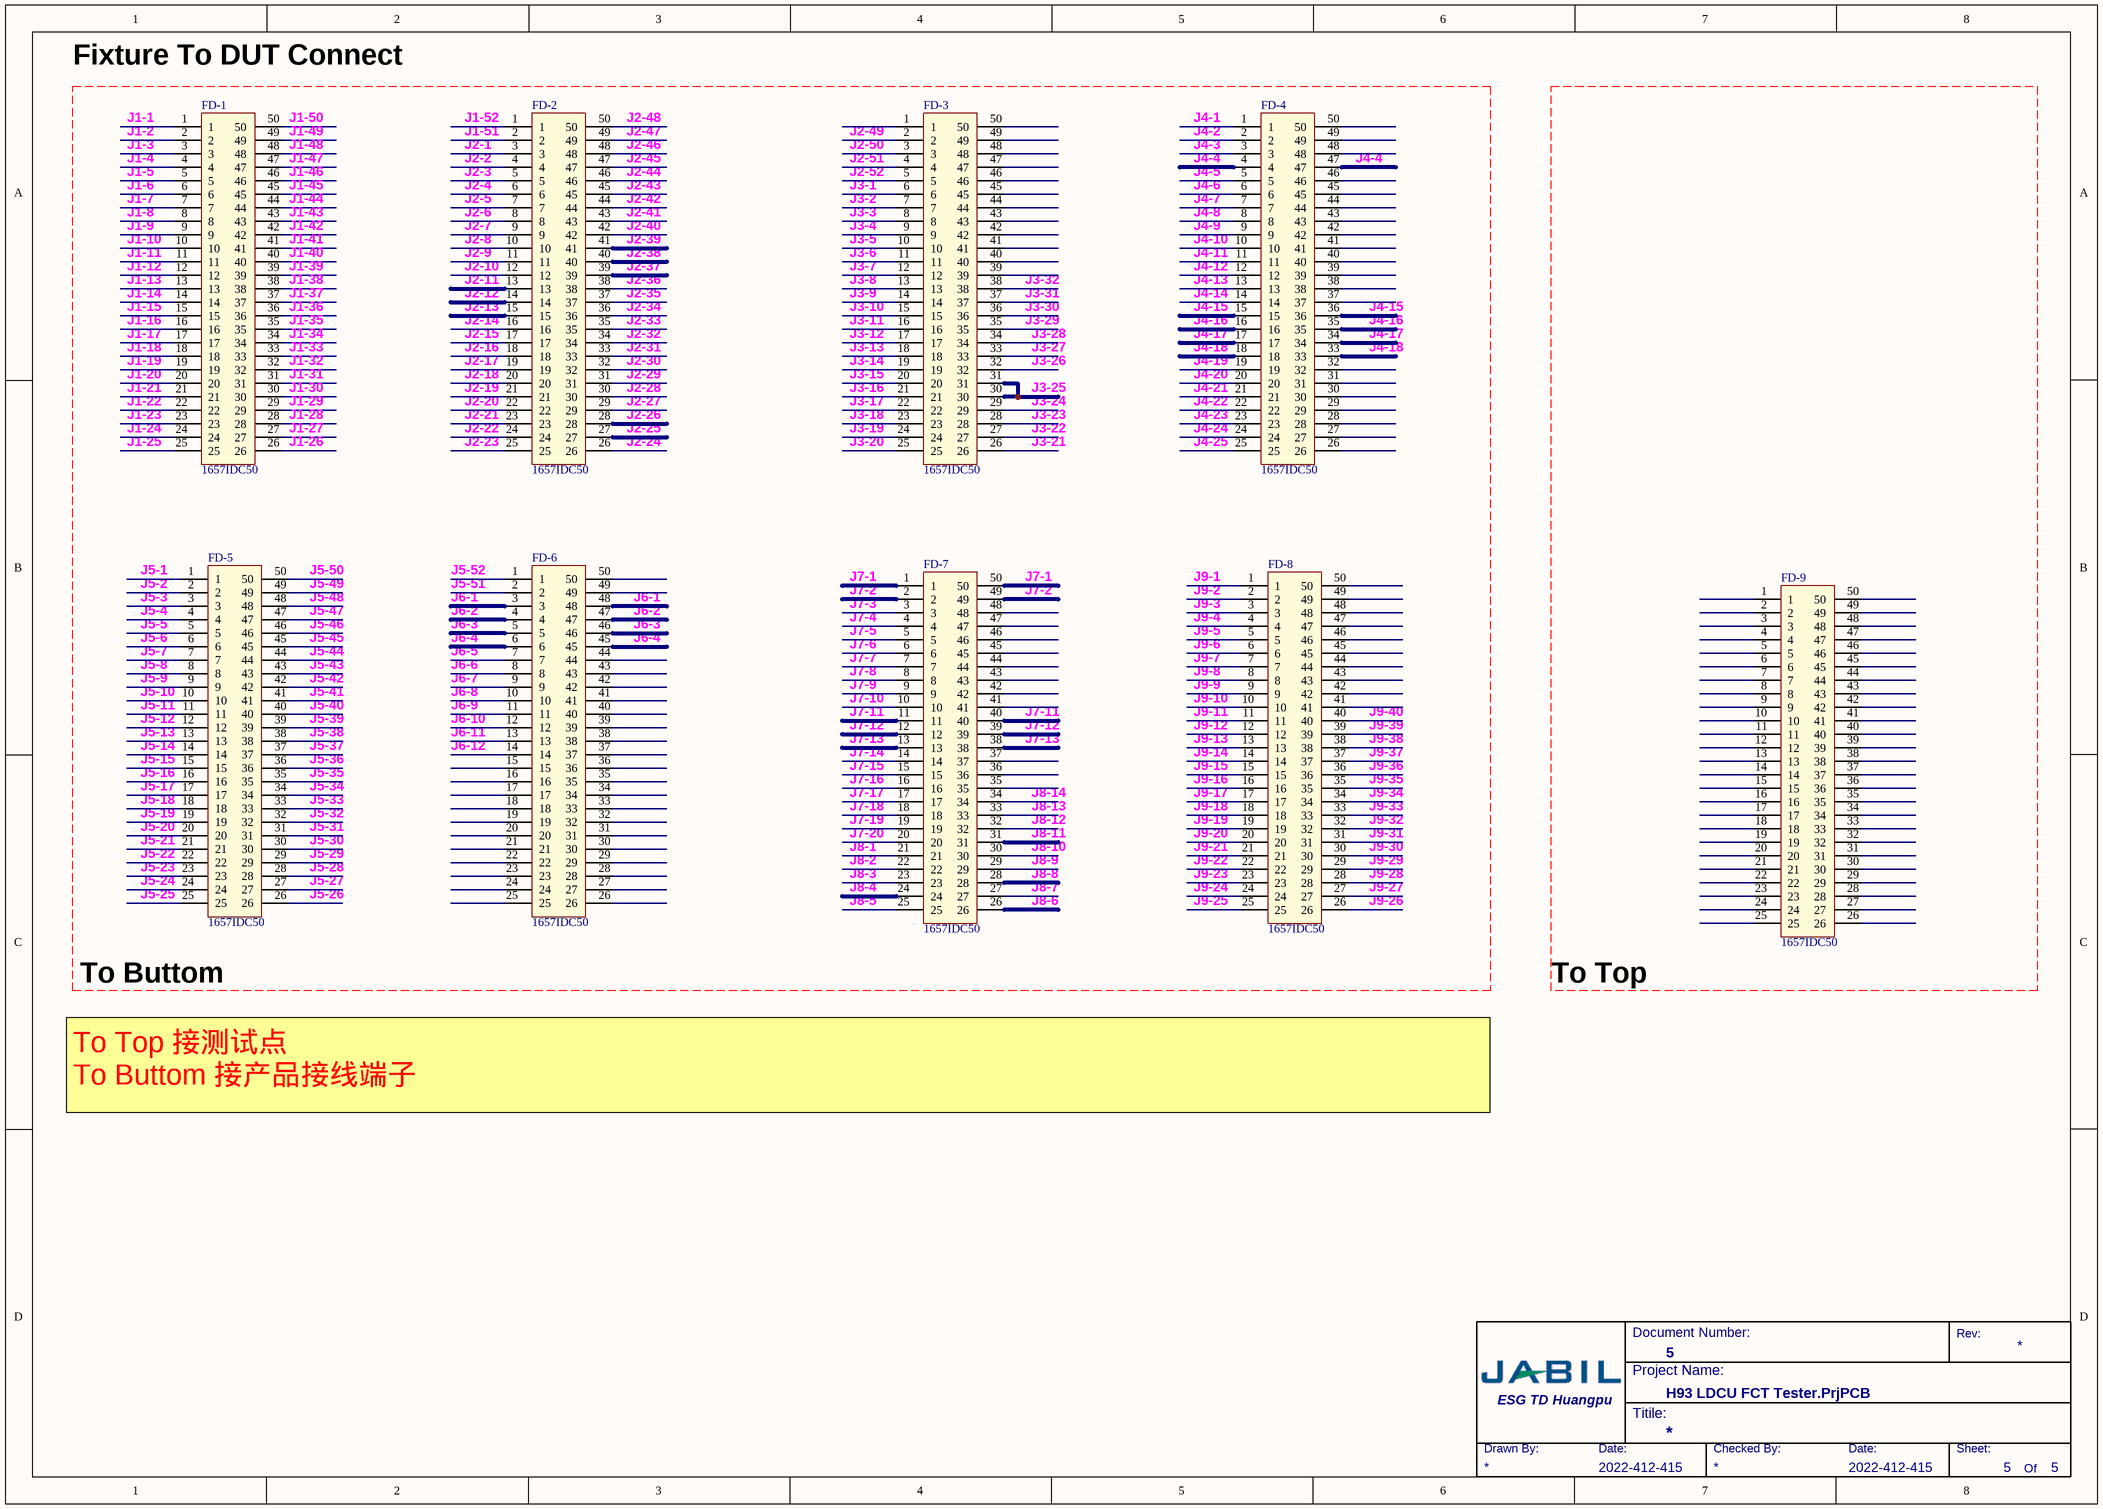
[diagram p4: DUT Connect Wiring.SchDoc]

### Parts
FD-1  1657IDC50
FD-2  1657IDC50
FD-3  1657IDC50
FD-4  1657IDC50
FD-5  1657IDC50
FD-6  1657IDC50
FD-7  1657IDC50
FD-8  1657IDC50
FD-9  1657IDC50

### Nets
J1-1: FD-1.1
J1-2: FD-1.2
J1-3: FD-1.3
J1-4: FD-1.4
J1-5: FD-1.5
J1-6: FD-1.6
J1-7: FD-1.7
J1-8: FD-1.8
J1-9: FD-1.9
J1-10: FD-1.10
J1-11: FD-1.11
J1-12: FD-1.12
J1-13: FD-1.13
J1-14: FD-1.14
J1-15: FD-1.15
J1-16: FD-1.16
J1-17: FD-1.17
J1-18: FD-1.18
J1-19: FD-1.19
J1-20: FD-1.20
J1-21: FD-1.21
J1-22: FD-1.22
J1-23: FD-1.23
J1-24: FD-1.24
J1-25: FD-1.25
J1-26: FD-1.26
J1-27: FD-1.27
J1-28: FD-1.28
J1-29: FD-1.29
J1-30: FD-1.30
J1-31: FD-1.31
J1-32: FD-1.32
J1-33: FD-1.33
J1-34: FD-1.34
J1-35: FD-1.35
J1-36: FD-1.36
J1-37: FD-1.37
J1-38: FD-1.38
J1-39: FD-1.39
J1-40: FD-1.40
J1-41: FD-1.41
J1-42: FD-1.42
J1-43: FD-1.43
J1-44: FD-1.44
J1-45: FD-1.45
J1-46: FD-1.46
J1-47: FD-1.47
J1-48: FD-1.48
J1-49: FD-1.49
J1-50: FD-1.50
J1-51: FD-2.2
J1-52: FD-2.1
J2-1: FD-2.3
J2-2: FD-2.4
J2-3: FD-2.5
J2-4: FD-2.6
J2-5: FD-2.7
J2-6: FD-2.8
J2-7: FD-2.9
J2-8: FD-2.10
J2-9: FD-2.11
J2-10: FD-2.12
J2-11: FD-2.13
J2-12: FD-2.14
J2-13: FD-2.15
J2-14: FD-2.16
J2-15: FD-2.17
J2-16: FD-2.18
J2-17: FD-2.19
J2-18: FD-2.20
J2-19: FD-2.21
J2-20: FD-2.22
J2-21: FD-2.23
J2-22: FD-2.24
J2-23: FD-2.25
J2-24: FD-2.26
J2-25: FD-2.27
J2-26: FD-2.28
J2-27: FD-2.29
J2-28: FD-2.30
J2-29: FD-2.31
J2-30: FD-2.32
J2-31: FD-2.33
J2-32: FD-2.34
J2-33: FD-2.35
J2-34: FD-2.36
J2-35: FD-2.37
J2-36: FD-2.38
J2-37: FD-2.39
J2-38: FD-2.40
J2-39: FD-2.41
J2-40: FD-2.42
J2-41: FD-2.43
J2-42: FD-2.44
J2-43: FD-2.45
J2-44: FD-2.46
J2-45: FD-2.47
J2-46: FD-2.48
J2-47: FD-2.49
J2-48: FD-2.50
J2-49: FD-3.2
J2-50: FD-3.3
J2-51: FD-3.4
J2-52: FD-3.5
J3-1: FD-3.6
J3-2: FD-3.7
J3-3: FD-3.8
J3-4: FD-3.9
J3-5: FD-3.10
J3-6: FD-3.11
J3-7: FD-3.12
J3-8: FD-3.13
J3-9: FD-3.14
J3-10: FD-3.15
J3-11: FD-3.16
J3-12: FD-3.17
J3-13: FD-3.18
J3-14: FD-3.19
J3-15: FD-3.20
J3-16: FD-3.21
J3-17: FD-3.22
J3-18: FD-3.23
J3-19: FD-3.24
J3-20: FD-3.25
J3-21: FD-3.26
J3-22: FD-3.27
J3-23: FD-3.28
J3-24: FD-3.29
J3-25: FD-3.30 FD-3.31
J3-26: FD-3.32
J3-27: FD-3.33
J3-28: FD-3.34
J3-29: FD-3.35
J3-30: FD-3.36
J3-31: FD-3.37
J3-32: FD-3.38
J4-1: FD-4.1
J4-2: FD-4.2
J4-3: FD-4.3
J4-4: FD-4.4 FD-4.47
J4-5: FD-4.5
J4-6: FD-4.6
J4-7: FD-4.7
J4-8: FD-4.8
J4-9: FD-4.9
J4-10: FD-4.10
J4-11: FD-4.11
J4-12: FD-4.12
J4-13: FD-4.13
J4-14: FD-4.14
J4-15: FD-4.15 FD-4.36
J4-16: FD-4.16 FD-4.35
J4-17: FD-4.17 FD-4.34
J4-18: FD-4.18 FD-4.33
J4-19: FD-4.19
J4-20: FD-4.20
J4-21: FD-4.21
J4-22: FD-4.22
J4-23: FD-4.23
J4-24: FD-4.24
J4-25: FD-4.25
J5-1: FD-5.1
J5-2: FD-5.2
J5-3: FD-5.3
J5-4: FD-5.4
J5-5: FD-5.5
J5-6: FD-5.6
J5-7: FD-5.7
J5-8: FD-5.8
J5-9: FD-5.9
J5-10: FD-5.10
J5-11: FD-5.11
J5-12: FD-5.12
J5-13: FD-5.13
J5-14: FD-5.14
J5-15: FD-5.15
J5-16: FD-5.16
J5-17: FD-5.17
J5-18: FD-5.18
J5-19: FD-5.19
J5-20: FD-5.20
J5-21: FD-5.21
J5-22: FD-5.22
J5-23: FD-5.23
J5-24: FD-5.24
J5-25: FD-5.25
J5-26: FD-5.26
J5-27: FD-5.27
J5-28: FD-5.28
J5-29: FD-5.29
J5-30: FD-5.30
J5-31: FD-5.31
J5-32: FD-5.32
J5-33: FD-5.33
J5-34: FD-5.34
J5-35: FD-5.35
J5-36: FD-5.36
J5-37: FD-5.37
J5-38: FD-5.38
J5-39: FD-5.39
J5-40: FD-5.40
J5-41: FD-5.41
J5-42: FD-5.42
J5-43: FD-5.43
J5-44: FD-5.44
J5-45: FD-5.45
J5-46: FD-5.46
J5-47: FD-5.47
J5-48: FD-5.48
J5-49: FD-5.49
J5-50: FD-5.50
J5-51: FD-6.2
J5-52: FD-6.1
J6-1: FD-6.3 FD-6.48
J6-2: FD-6.4 FD-6.47
J6-3: FD-6.5 FD-6.46
J6-4: FD-6.6 FD-6.45
J6-5: FD-6.7
J6-6: FD-6.8
J6-7: FD-6.9
J6-8: FD-6.10
J6-9: FD-6.11
J6-10: FD-6.12
J6-11: FD-6.13
J6-12: FD-6.14
J7-1: FD-7.1 FD-7.50
J7-2: FD-7.2 FD-7.49
J7-3: FD-7.3
J7-4: FD-7.4
J7-5: FD-7.5
J7-6: FD-7.6
J7-7: FD-7.7
J7-8: FD-7.8
J7-9: FD-7.9
J7-10: FD-7.10
J7-11: FD-7.11 FD-7.40
J7-12: FD-7.12 FD-7.39
J7-13: FD-7.13 FD-7.38
J7-14: FD-7.14
J7-15: FD-7.15
J7-16: FD-7.16
J7-17: FD-7.17
J7-18: FD-7.18
J7-19: FD-7.19
J7-20: FD-7.20
J8-1: FD-7.21
J8-2: FD-7.22
J8-3: FD-7.23
J8-4: FD-7.24
J8-5: FD-7.25
J8-6: FD-7.26
J8-7: FD-7.27
J8-8: FD-7.28
J8-9: FD-7.29
J8-10: FD-7.30
J8-11: FD-7.31
J8-12: FD-7.32
J8-13: FD-7.33
J8-14: FD-7.34
J9-1: FD-8.1
J9-2: FD-8.2
J9-3: FD-8.3
J9-4: FD-8.4
J9-5: FD-8.5
J9-6: FD-8.6
J9-7: FD-8.7
J9-8: FD-8.8
J9-9: FD-8.9
J9-10: FD-8.10
J9-11: FD-8.11
J9-12: FD-8.12
J9-13: FD-8.13
J9-14: FD-8.14
J9-15: FD-8.15
J9-16: FD-8.16
J9-17: FD-8.17
J9-18: FD-8.18
J9-19: FD-8.19
J9-20: FD-8.20
J9-21: FD-8.21
J9-22: FD-8.22
J9-23: FD-8.23
J9-24: FD-8.24
J9-25: FD-8.25
J9-26: FD-8.26
J9-27: FD-8.27
J9-28: FD-8.28
J9-29: FD-8.29
J9-30: FD-8.30
J9-31: FD-8.31
J9-32: FD-8.32
J9-33: FD-8.33
J9-34: FD-8.34
J9-35: FD-8.35
J9-36: FD-8.36
J9-37: FD-8.37
J9-38: FD-8.38
J9-39: FD-8.39
J9-40: FD-8.40

Not connected (* = marked no-connect by the designer): FD-3 1 39 40 41 42 43 44 45 46 47 48 49 50; FD-4 26 27 28 29 30 31 32 37 38 39 40 41 42 43 44 45 46 48 49 50; FD-6 15 16 17 18 19 20 21 22 23 24 25 26 27 28 29 30 31 32 33 34 35 36 37 38 39 40 41 42 43 44 49 50; FD-7 35 36 37 41 42 43 44 45 46 47 48; FD-8 41 42 43 44 45 46 47 48 49 50; FD-9 1 2 3 4 5 6 7 8 9 10 11 12 13 14 15 16 17 18 19 20 21 22 23 24 25 26 27 28 29 30 31 32 33 34 35 36 37 38 39 40 41 42 43 44 45 46 47 48 49 50

### Notes on the sheet
- Fixture To DUT Connect
- To Buttom
- To Top
- To Top 接测试点
  To Buttom 接产品接线端子
- Document Number:
- Project Name:
- Rev:
- Drawn By:
- Date:
- Titile:
- Checked By:
- Sheet:
- Of

## Sheet Sheet1.SchDoc
size A3
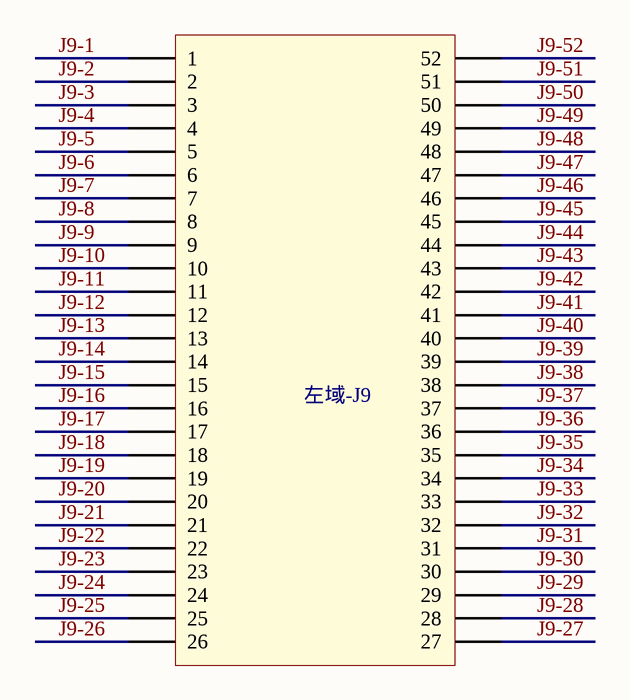
[diagram p5: Sheet1.SchDoc]

### Parts
*  左域-J9

### Nets
J9-1: *.1
J9-2: *.2
J9-3: *.3
J9-4: *.4
J9-5: *.5
J9-6: *.6
J9-7: *.7
J9-8: *.8
J9-9: *.9
J9-10: *.10
J9-11: *.11
J9-12: *.12
J9-13: *.13
J9-14: *.14
J9-15: *.15
J9-16: *.16
J9-17: *.17
J9-18: *.18
J9-19: *.19
J9-20: *.20
J9-21: *.21
J9-22: *.22
J9-23: *.23
J9-24: *.24
J9-25: *.25
J9-26: *.26
J9-27: *.27
J9-28: *.28
J9-29: *.29
J9-30: *.30
J9-31: *.31
J9-32: *.32
J9-33: *.33
J9-34: *.34
J9-35: *.35
J9-36: *.36
J9-37: *.37
J9-38: *.38
J9-39: *.39
J9-40: *.40
J9-41: *.41
J9-42: *.42
J9-43: *.43
J9-44: *.44
J9-45: *.45
J9-46: *.46
J9-47: *.47
J9-48: *.48
J9-49: *.49
J9-50: *.50
J9-51: *.51
J9-52: *.52

### Library data of the parts
* = 左域-J4

## Sheet Sheet2.SchDoc
size A3